# EAGLE design source_eagle (EAGLE 9.6.2)
COMPANY: ADAFRUIT INDUSTRIES; DRAWN: KTOWN; REV: A; YEAR: 2019
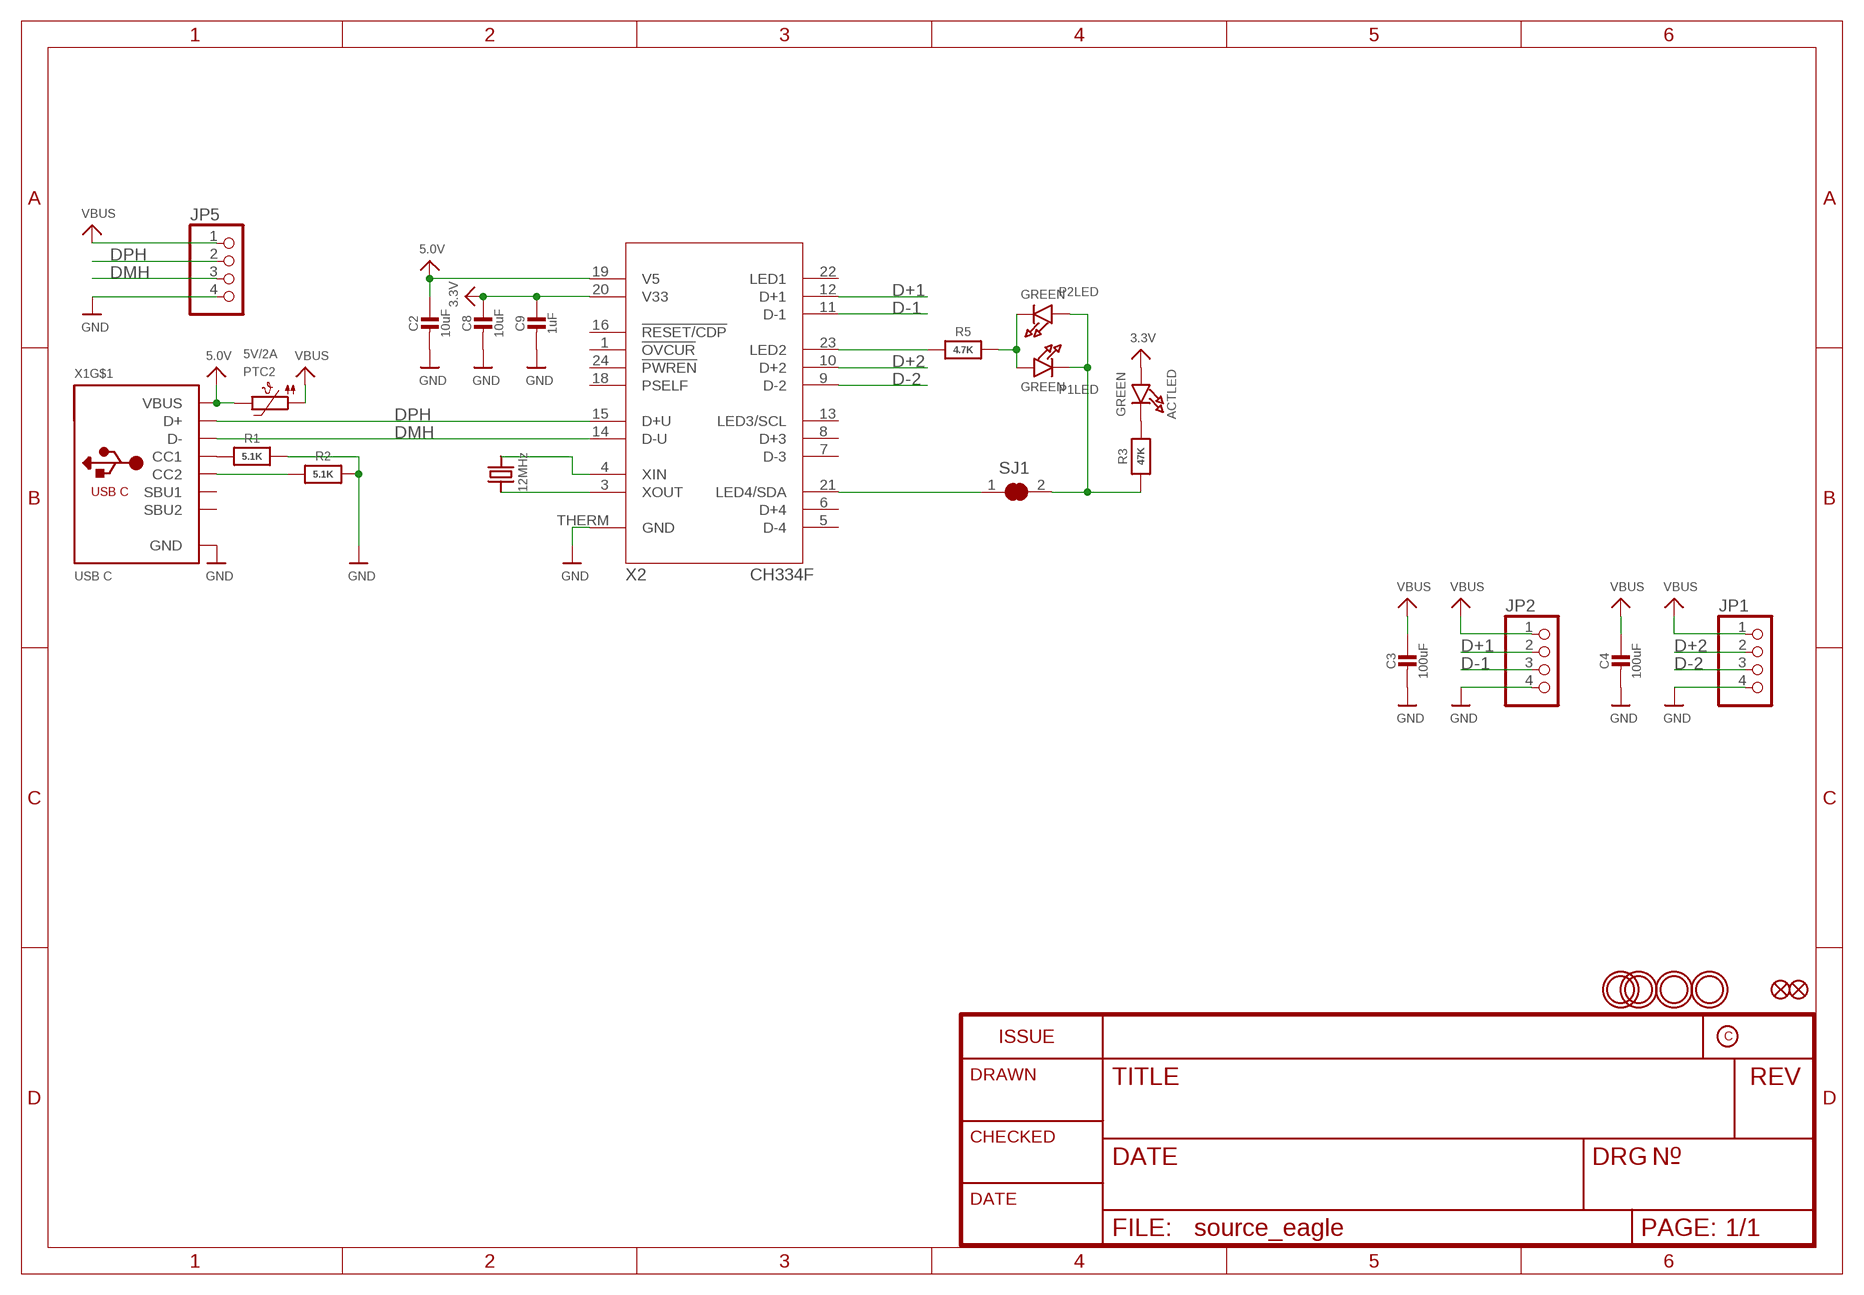
[diagram p0: schematic, sheet 1]

## Parts
ACTLED  GREEN  LED0603_NOOUTLINE  [CHIPLED_0603_NOOUTLINE]
C2  10uF  CAP_CERAMIC0805-NOOUTLINE  [0805-NO]
C3  100uF  CAP_CERAMIC_1206  [_1206]
C4  100uF  CAP_CERAMIC_1206  [_1206]
C8  10uF  CAP_CERAMIC0805-NOOUTLINE  [0805-NO]
C9  1uF  CAP_CERAMIC0603_NO  [0603-NO]
FID1  FIDUCIAL_0.5MM  [FIDUCIAL_0.5MM]
FID2  FIDUCIAL_0.5MM  [FIDUCIAL_0.5MM]
JP1  HEADER-1X4ROUND  [1X04_ROUND]
JP2  HEADER-1X4ROUND  [1X04_ROUND]
JP5  HEADER-1X4ROUND  [1X04_ROUND]
P1LED  GREEN  LED0603_NOOUTLINE  [CHIPLED_0603_NOOUTLINE]
P2LED  GREEN  LED0603_NOOUTLINE  [CHIPLED_0603_NOOUTLINE]
PTC2  5V/2A  PTC_0805  [0805-NO]
R1  5.1K  RESISTOR_0603_NOOUT  [0603-NO]
R2  5.1K  RESISTOR_0603_NOOUT  [0603-NO]
R3  47K  RESISTOR_0603_NOOUT  [0603-NO]
R5  4.7K  RESISTOR_0603_NOOUT  [0603-NO]
SJ1  SOLDERJUMPER_CLOSED  [SOLDERJUMPER_CLOSEDWIRE]
U$23  MOUNTINGHOLE2.5  [MOUNTINGHOLE_2.5_PLATED]
U$28  MOUNTINGHOLE2.5  [MOUNTINGHOLE_2.5_PLATED]
U$29  MOUNTINGHOLE2.5  [MOUNTINGHOLE_2.5_PLATED]
U$31  MOUNTINGHOLE2.5  [MOUNTINGHOLE_2.5_PLATED]
X1  USB C  USB_C  [USB_C_CUSB31-CFM2AX-01-X]
X2  CH334F  [QFN24_4MM]
Y1  12MHz  CRYSTAL2.5X2.0  [CRYSTAL_2.5X2]

## Nets
3.3V: ACTLED.A C8.1 C9.1 X2.20(V33)
5.0V: C2.1 PTC2.2 X1.A4B9(VBUS) X1.B4A9(VBUS) X2.19(V5)
D+1: JP2.2 X2.12(D+1)
D+2: JP1.2 X2.10(D+2)
D-1: JP2.3 X2.11(D-1)
D-2: JP1.3 X2.9(D-2)
DMH: JP5.3 X1.A7(D-) X1.B7(D-) X2.14(D-U)
DPH: JP5.2 X1.A6(D+) X1.B6(D+) X2.15(D+U)
GND: C2.2 C3.2 C4.2 C8.2 C9.2 JP1.4 JP2.4 JP5.4 R1.2 R2.2 X1.A1B12(GND) X1.B1A12(GND) X2.THERM(GND)
N$1: R1.1 X1.A5(CC1)
N$2: R2.1 X1.B5(CC2)
N$3: X2.3(XOUT) Y1.1
N$4: X2.4(XIN) Y1.3
N$5: ACTLED.C R3.2
N$6: P1LED.C P2LED.A R3.1 SJ1.2
N$9: SJ1.1 X2.21(LED4/SDA)
N$10: P1LED.A P2LED.C R5.2
N$12: R5.1 X2.23(LED2)
VBUS: C3.1 C4.1 JP1.1 JP2.1 JP5.1 PTC2.1
Unconnected: X1.A8(SBU1) X1.B8(SBU2) X1.M1(MT) X1.M2(MT) X1.M3(MT) X1.M4(MT) X2.1(!OVCUR) X2.5(D-4) X2.6(D+4) X2.7(D-3) X2.8(D+3) X2.13(LED3/SCL) X2.16(!RESET/CDP) X2.18(PSELF) X2.22(LED1) X2.24(!PWREN)

## Library data of the parts
ACTLED P1LED P2LED = microbuilder:LED: LED 0603 - 0603 Surface Mount Package 2mA: Green LED - Low Power (3.9mcd, 2ma, 1.7Vf) - Digikey: 475-2709-2-ND Orange LED - Low Power (9.8mcd, 2ma, 1.8Vf) - Digikey: 475-1194-2-ND Red LED - Low Power (5mcd, 2ma, 1.8Vf) - Digikey: 475-1195-2-ND Yellow LED - Low Power (7mcd, 2ma, 1.8Vf) - Digikey: 475-1196-2-ND 5mA: Blue LED - Low Power (17mcd, 5ma, 2.9Vf) - Digikey: LNJ937W8CRACT-ND 0805 - 0805 Surface Mount Package 2mA: Red LED (8.8mcd, 2mA, 1.8Vf, Clear) - Low Power [Digikey: 475-2510-1-ND] Green LED (5mcd, 2mA, 1.8Vf, Clear) - Low Power [Digikey: 475-2730-1-ND] Yellow LED (11.3mcd, 2mA, 1.8Vf, Clear) - Low Power [Digikey: 475-2555-1-ND] 20mA: Red LED (104mcd, 20mA, Diffused) - LS R976 [Digikey: 475-1278-6-ND] Red LED (12mcd, 20mA, 2.0Vf, Clear) - APT2012EC [Digikey: 754-1128-1-ND] Green LED (15mcd, 20mA, 2.2Vf, Clear) - APT2012GC [Digikey: 754-1131-1-ND] Orange LED (160mcd, 20mA, 2.1Vf, Clear) - APT2012SECK [Digikey: 754-1130-1-ND] 1206 - 1206 Surface Mount Package Green LED (26mcd, 20mA, Diffused) - LG N971 [Digikey: 475-1407-6-ND] Red LED (15mcd, 20mA, Diffused) - LH N974 [Digikey: 475-1416-6-ND] Cree - Cree High-Power Surface Mount LEDs XPEBWT-L1-0000-00D50 - White 111lm 350mA 2.9Vf 6200K 110° XTEAWT-00-0000-00000LEE3 - White 114lm 350mA 2.85Vf 5000K 115° Everlight - Everlight 45-21 Series Surface Mount LEDs 45-21/QK2C-B2832AC2CB2/2T - Warm White 2000mcd 20mA 3.25Vf 3050K 120° 45-21/LK2C-B38452C4CB2/2T - Nuetral White 2000mcd 20mA 3.25Vf 4150K 120° 45-21/LK2C-B50634C6CB2/2T - Cold White 2200mcd 20mA 3.25Vf 5650K 120° PLCC2 Reverse Mount LS T77K-J1L2-1-0-2-R18-Z - Red 11.25mcd 2mA 1.8Vf 630nm 120° LO T77K-L1M2-24-Z - Orange 19.6mcd 2mA 1.8Vf 606nm 120° LY T77K-K2M1-26-Z - Yellow 15.7mcd 2mA 1.8Vf 587nm 120°; ROT: 270
C2-C4 C8 C9 = microbuilder:CAP_CERAMIC: Ceramic Capacitors For new designs, use the packages preceded by an '_' character since they are more reliable: The following footprints should be used on most boards: _0402 - Standard footprint for regular board layouts _0603 - Standard footprint for regular board layouts _0805 - Standard footprint for regular board layouts _1206 - Standard footprint for regular board layouts For extremely tight-pitch boards where space is at a premium, the following 'micro-pitch' footprints can be used (smaller pads, no silkscreen outline, etc.): _0402MP - Micro-pitch footprint for very dense/compact boards _0603MP - Micro-pitch footprint for very dense/compact boards _0805MP - Micro-pitch footprint for very dense/compact boards _1206MP - Micro-pitch footprint for very dense/compact boards
FID1 FID2 = microbuilder:FIDUCIAL: Fiducial Alignment Points Various fiducial points for machine vision alignment.
JP1 JP2 JP5 = microbuilder:HEADER-1X4: PIN HEADER
PTC2 = microbuilder:PTC: PTC (Resettable Fuse) 1206 Package 250mA PTC (16V Max, Time-to-Trip: 0.08s) - Digikey: F2110CT-ND 1210 Package 100mA PTC (30V Max, Time-to-Trip: 0.6s) - Digikey: MF-USMF010-2CT-ND 1812 Package 750mA PTC (24V Max, Time-to-Trip: 0.2s) - Digikey: MF-MSMF075/24-2CT-ND
R1-R3 R5 = microbuilder:RESISTOR: Resistors For new designs, use the packages preceded by an '_' character since they are more reliable: The following footprints should be used on most boards: _0402 - Standard footprint for regular board layouts _0603 - Standard footprint for regular board layouts _0805 - Standard footprint for regular board layouts _1206 - Standard footprint for regular board layouts For extremely tight-pitch boards where space is at a premium, the following 'micro-pitch' footprints can be used (smaller pads, no silkscreen outline, etc.): _0402MP - Micro-pitch footprint for very dense/compact boards _0603MP - Micro-pitch footprint for very dense/compact boards _0805MP - Micro-pitch footprint for very dense/compact boards _1206MP - Micro-pitch footprint for very dense/compact boards
SJ1 = microbuilder:SOLDERJUMPER_CLOSED: Solder Jumper - Closed These solder jumpers are closed by default CLOSEDWIRE - 10 mil trace between pads that can be cut and resoldered later CLOSEDPERM - 63 mil trace between pads for a permanent connection (used to 'bridge' two signals, a shameless hack for Eagle). Can double as a test point as well (no cream layer)
U$23 U$28 U$29 U$31 = microbuilder:MOUNTINGHOLE: Mounting Hole For #2 screws (0.086"/2.18mm width, 0.094"/2.4mm hole) use 2.5mm; BOM: EXCLUDE
X1 = adafruit_electromech:USB_C: USB Type-C USB 2.0 Connector; LCSC: C165948
X2 = adafruit_micro:CH334F
Y1 = microbuilder:CRYSTAL: Crystals HC49UP - Surface Mount Crystal 4.0MHz 18pF +/-30ppm Surface Mount Crystal [Digikey: 535-9857-1-ND] 12.0 MHz Surface Mount Crystal [Digikey: 535-9869-6-ND] 25.0 MHz Surface Mount Crystal [Digikey: 535-9078-1-ND] 2.5 x 2.0mm - MEMs SMT Crystal 16.0 MHz 10pF 20ppm 2.5 x 2.0mm Crystal [Digikey -40-85°C: 535-10923-1-ND] 3.2 x 2.5mm - MEMs SMT Crystal 12.0 MHz 8pF 15ppm 3.2 x 2.5mm Crystal [Digikey: -10-70°C: 644-1047-1-ND -40-125°C: 644-1128-1-ND] 40~85°C cheaper: 644-1173-6-ND 16.0 MHz 8pF 15ppm 3.2 x 2.5mm Crystal [Digikey: -10-70°C: 644-1049-1-ND -40-125°C: 644-1129-2-ND]-40~85°C cheaper: 644-1175-6-ND 16.0 MHz 10pF 10ppm 3.2 x 2.5mm Crystal [Digikey: 644-1100-1-ND] 27.12 MHz 18pF 30ppm 3.2 x 2.5mm Crystal [Digikey: 887-1424-1-ND] 27.12MHz 10pF 10ppm 3.2 x 2.5mm Crystal [Digikey: 887-1329-1-ND] 4.9 x 1.8mm - MEMs SMT Crystal 32.768 KHz 12.5pF 20ppm 4.9 x 1.8mm Crystal [Digikey: SE2415CT-ND] 8.0 x 3.8mm - Surface Mount Crystal 32.768kHz 12.5pF 20ppm -40°C-85°C [Digikey: 535-9166-2-ND] Cylinder 32.768KHz Cylinder Crystal (2x6mm body) [Ex. Digikey: 300-8341-2-ND]

## Board
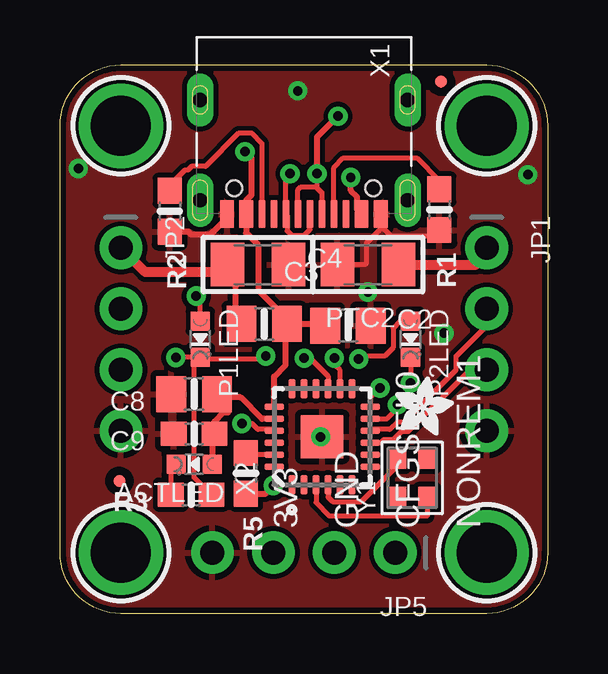
[diagram p1: board, top side]
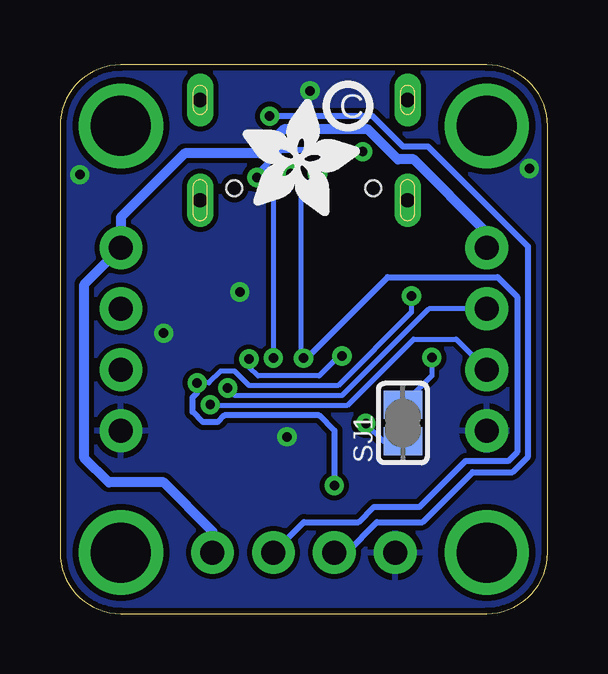
[diagram p2: board, bottom side, seen from below]

Size 20.32 x 22.86 mm. Coordinates in mm from the lower left corner, seen from the top.
Outline: 20.32,20.32 20.32,2.54 arc-90 17.78,0 2.54,0 arc-90 0,2.54 0,20.32 arc-90 2.54,22.86 17.78,22.86 arc-90 20.32,20.32
Copper layers (1*16): Top 0.035mm / dielectric 1.5mm / Bottom 0.035mm
Design rules "adafruit": minimum track width 8mil, minimum drill 15.5mil, track to track 8mil, track to pad 8mil, pad to pad 8mil, via to via 8mil, smd to smd 8mil, copper to edge 10mil, drill to drill 8mil, minimum pad ring 10mil, minimum via ring 8mil, stop-mask expansion 2mil, vias tented up to drill 20mil, thermal gap 10mil

### Footprints (pad centres in the part's own frame; a part is rotated, then mirrored left to right if it is on the bottom)
CHIPLED_0603_NOOUTLINE = smd 0.8 x 0.8: A 0,-0.75; C 0,0.75
0805-NO = smd 1.24 x 1.5: 1 -0.95,0; 2 0.95,0
_1206 = smd 1.4 x 1.8: 1 -1.27,0; 2 1.27,0
0603-NO = smd 1.075 x 1: 1 -0.85,0; 2 0.85,0
FIDUCIAL_0.5MM = smd 0.5 x 0.5: 1 0,0
1X04_ROUND = drill 1 pad 1.778: 1 -3.81,0; 2 -1.27,0; 3 1.27,0; 4 3.81,0
SOLDERJUMPER_CLOSEDWIRE = smd 1.168 x 1.6: 1 -0.762,0; 2 0.762,0 | smd 0.635 x 0.203: WIRE 0,0
MOUNTINGHOLE_2.5_PLATED = drill 2.5 pad 3.2: P$1 0,0
USB_C_CUSB31-CFM2AX-01-X = smd 0.575 x 1.15: A1B12 -3.2,2.275; A4B9 -2.4,2.275; B1A12 3.2,2.275; B4A9 2.4,2.275 | smd 0.275 x 1.15: A5 -1.25,2.275; A6 -0.25,2.275; A7 0.25,2.275; A8 1.25,2.275; B5 1.75,2.275; B6 0.75,2.275; B7 -0.75,2.275; B8 -1.75,2.275 | drill 0.6 pad 1 long: M1 -4.32,1.7; M2 4.32,1.7; M3 -4.32,-2.48; M4 4.32,-2.48 | hole 0.65: 2.89,1.2; -2.89,1.2
QFN24_4MM = smd 0.8 x 0.28: 1 -2,1.25; 2 -2,0.75; 3 -2,0.25; 4 -2,-0.25; 5 -2,-0.75; 6 -2,-1.25; 13 2,-1.25; 14 2,-0.75; 15 2,-0.25; 16 2,0.25; 17 2,0.75; 18 2,1.25 | smd 0.28 x 0.8: 7 -1.25,-2; 8 -0.75,-2; 9 -0.25,-2; 10 0.25,-2; 11 0.75,-2; 12 1.25,-2; 19 1.25,2; 20 0.75,2; 21 0.25,2; 22 -0.25,2; 23 -0.75,2; 24 -1.25,2 | smd 1.778 x 1.778: THERM 0,0
CRYSTAL_2.5X2 = smd 0.9 x 0.75: 1 -0.825,-0.625; 2 0.825,-0.625; 3 0.825,0.625; 4 -0.825,0.625

### Placement (x,y rotation side)
ACTLED  5.59,6.22 90 top
C2  12,12 0 top
C3  12.83,14.54 180 top
C4  8.26,14.54 0 top
C8  5.59,9.14 180 top
C9  5.59,7.49 180 top
FID1  2.48,5.52 180 top
FID2  15.88,22.16 180 top
JP1  17.78,11.43 270 top
JP2  2.54,11.43 270 top
JP5  10.16,2.54 180 top
P1LED  5.84,11.43 180 top
P2LED  14.61,11.43 180 top
PLABEL0  [PLABEL0]  0.89,7.37 90 top
PLABEL1  [PLABEL1]  19.43,7.05 90 top
PLABEL3  [PLABEL3]  19.43,12.89 90 top
PLABEL5  [PLABEL5]  0.89,13.08 90 top
PLABEL6  [PLABEL6]  0.89,10.41 90 top
PLABEL7  [PLABEL7]  0.89,15.62 90 top
PLABEL8  [PLABEL8]  19.43,10.29 90 top
PLABEL11  [PLABEL11]  19.43,15.18 90 top
PLABEL13  [PLABEL13]  16,12.7 90 top
PLABEL19  [PLABEL19]  4.45,12.7 90 top
PLABEL21  [PLABEL21]  6.03,0.95 0 top
PLABEL22  [PLABEL22]  11.56,0.95 0 top
PLABEL23  [PLABEL23]  9.08,0.95 0 top
PLABEL24  [PLABEL24]  13.97,0.95 0 top
PLABEL26  [PLABEL26]  10.16,14.8 0 bottom
PLABEL27  [PLABEL27]  19.56,11.62 90 bottom
PLABEL30  [PLABEL30]  0.95,11.37 90 bottom
PLABEL31  [PLABEL31]  5.97,5.46 0 bottom
PLABEL32  [PLABEL32]  10.16,0.89 0 bottom
PLABEL33  [PLABEL33]  15.43,5.08 0 bottom
PTC2  8.51,12.06 0 top
R1  15.81,16.83 270 top
R2  4.57,16.76 270 top
R3  5.46,4.95 180 top
R5  7.75,5.84 270 top
SJ1  6.03,7.94 90 bottom
U$11  [ADAFRUIT_2.5MM]  13.97,7.43 0 top
U$23  17.78,2.54 180 top
U$28  2.54,20.32 0 top
U$29  17.78,20.32 0 top
U$31  2.54,2.54 180 top
U$33  [ADAFRUIT_5MM]  12.7,16.57 0 bottom
U$34  [PCBFEAT-REV-040]  8.32,21.15 0 bottom
X1  10.16,18.92 180 top
X2  10.92,7.37 90 top
Y1  14.67,5.65 90 top

### Tracks (layer width: path | path; a pad name or v marks a point on that pad's centre or on a via)
3.3V
  Top 0.254: X2.20 8.41,8.12 7.53,9.01 6.54,9.01 | 6.54,9.01 6.54,8.83 7,8.37 6.81,8.37 6.44,8 C9.1 6.34,7.39 ACTLED.A | 6.54,9.01 C8.1
5.0V  (via drill 0.39)
  Top 0.254: X2.19 8.92,9.88 9.4,10.35 9.4,12 PTC2.2 | X1.A4B9 12.38,16.83 12.38,17.36 12.12,17.62 v12.12,18.17 | v7.71,19.24 7.98,18.97 7.98,17.43 7.76,17.21 X1.B4A9 7.76,15.86 8.26,15.37 8.26,13.46 9.46,12.26 PTC2.2 | PTC2.2 10.99,12.06 C2.1
  Bottom 0.254: v12.12,18.17 12.12,18.3 11.1,19.32 7.78,19.32 v7.71,19.24
D+1  (via drill 0.39)
  Top 0.203: v13.34,9.4 12.92,8.98 X2.12
  Bottom 0.203: v13.34,9.4 13.03,9.09 8.56,9.09 4.95,12.7 JP2.2
D+2
  Top 0.203: JP1.2 17.78,12 16.51,10.73 16.51,10.16 14.35,8 14.06,8 13.74,7.67 12.98,7.67 X2.10
D-1  (via drill 0.39)
  Top 0.203: v14.06,8.7 14.06,8.57 13.61,8.12 X2.11
  Bottom 0.203: v14.06,8.7 14.06,8.69 8.33,8.69 5.59,11.43 3.81,11.43 JP2.3
D-2
  Top 0.203: X2.9 13.37,7.12 13.49,7.24 13.88,7.24 14.23,7.59 14.52,7.59 17.09,10.16 JP1.3
DMH  (via drill 0.39)
  Top 0.203: X1.A7 9.91,17.66 10.03,17.78 10.67,17.78 10.71,17.74 | X1.B7 10.91,17.54 10.71,17.74 | v10.71,18.33 10.71,17.74 | v11.43,10.65 11.43,10.37 11.67,10.13 X2.14
  Top 0.254: v11.58,20.73 10.71,19.85 v10.71,18.33
  Bottom 0.203: v11.43,10.65 11.43,17.61 v10.71,18.33
  Bottom 0.254: JP5.3 8.38,2.54 7.11,3.81 5.21,3.81 3.12,5.89 1.46,5.89 0.81,6.54 0.81,15.29 4.98,19.46 6.02,19.46 7.29,20.73 v11.58,20.73
DPH  (via drill 0.39)
  Top 0.203: X1.A6 10.41,16 10.29,15.88 10.28,15.88 10.17,15.77 9.65,15.77 9.47,15.95 9.47,16.59 X1.B6 9.41,18.15 v9.59,18.33 | v10.17,10.64 10.43,10.64 11.17,9.9 X2.15
  Bottom 0.203: v9.59,18.33 10.29,17.63 10.29,10.67 10.26,10.64 v10.17,10.64
  Bottom 0.254: v10.17,10.64 10.05,10.64 6.67,14.02 2.08,14.02 1.27,13.21 1.27,6.73 1.65,6.35 3.43,6.35 5.33,4.45 7.24,4.45 7.87,3.81 10.16,3.81 JP5.2
GND  (via drill 0.39)
  Top 0.203: C3.2 12.7,14.54 12.76,14.61 12.76,15.43 13.36,16.03 X1.A1B12 13.36,16.17 13.78,15.75 15.58,15.75 R1.2
  Top 0.254: X1.B1A12 6.96,16.48 6.26,15.79 5.47,15.79 5.34,15.91 R2.2
  other vias: 12.83,13.4 9.91,21.78 0.76,18.54 19.49,18.29 16,11.68 10.86,7.37
  pour Top: 0,22.86 0,0 20.32,0 20.32,22.86
  pour Bottom: 0,22.86 0,0 20.32,0 20.32,22.86
N$1
  Top 0.203: X1.A5 11.41,18.59 11.81,18.99 14.86,18.99 15.81,18.03 R1.1
N$2
  Top 0.203: R2.1 4.57,17.84 5.21,18.48 5.33,18.48 5.48,18.64 6.06,18.64 7.43,20 8,20 8.41,19.59 X1.B5
N$3
  Top 0.203: Y1.1 15.29,4.06 11.24,4.06 10.67,4.63 X2.3
N$4
  Top 0.203: X2.4 11.17,4.85 11.36,4.66 12.54,4.66 14.04,6.16 Y1.3
N$5
  Top 0.203: ACTLED.C 4.61,6 R3.2
N$6  (via drill 0.39)
  Top 0.203: P1LED.C 5.92,10.6 8.45,10.6 v8.57,10.73 | v12.45,10.6 12.57,10.73 13.53,10.73 13.88,11.08 13.88,11.9 14.16,12.18 P2LED.A | P1LED.C 5.59,10.43 5.59,5.68 R3.1 | P1LED.C v4.84,10.68 v4.83,10.67
  Bottom 0.203: v8.57,10.73 8.7,10.73 9.53,9.91 12.06,9.91 12.45,10.29 v12.45,10.6 | SJ1.2 4.83,9.91 v4.83,10.67
N$9  (via drill 0.39)
  Top 0.203: X2.21 8.87,7.67 8.25,7.67 8,7.92 v7.58,7.92
  Bottom 0.203: v7.58,7.92 6.84,7.18 SJ1.1
N$10  (via drill 0.39)
  Top 0.203: P2LED.C v14.61,9.61 | P1LED.A 5.84,13.06 v5.67,13.23
  Top 0.254: R5.2 8.55,4.99 v8.89,5.33
  Bottom 0.203: v14.61,9.61 14.12,9.61 13.63,10.1 13.04,10.1 12.44,9.5 8.73,9.5 5.67,12.55 v5.67,13.23
  Bottom 0.254: v8.89,5.33 8.89,7.62 9.53,8.26 13.47,8.26 13.76,7.97 14.36,7.97 14.79,8.4 14.79,9.01 14.61,9.19 v14.61,9.61
N$12
  Top 0.203: X2.23 7.82,6.62 R5.1
VBUS
  Top 0.254: C4.1 7.3,14.22 7.3,12.32 PTC2.1
  Top 0.406: C3.1 17.34,14.54 17.78,14.99 JP1.1 | C4.1 6.67,14.22 3.56,14.22 JP2.1
  Bottom 0.406: JP5.1 13.97,3.43 16,5.46 18.29,5.46 19.3,6.48 19.3,13.72 JP1.1 17.78,16.51 15.11,19.18 11.99,19.18 10.99,20.17 7.5,20.17 6.24,18.92 5.59,18.92 2.54,15.88 JP2.1

### Text on the board
tNames: 3V3 | GND | CFGSEL0 | NONREM1
Pinguin_tBackup: 5V | 5V | D+ | D+ | PORT1 | PORT2 | D- | D- | GND | GND | 5V | 5V | D+ | D+ | PORT3 | PORT4 | D- | D- | GND | GND | GND | D- | D+ | 5V | USBHOST
Pinguin_bBackup: Port2 | Port1 | CH334F | LEDs | Port4 | Port3 | Mini USB / 4-Port Hub | Mini USB / 2-Port / Hub | Host Port